# Altium schematic sheet FPGA.SchDoc
size A2
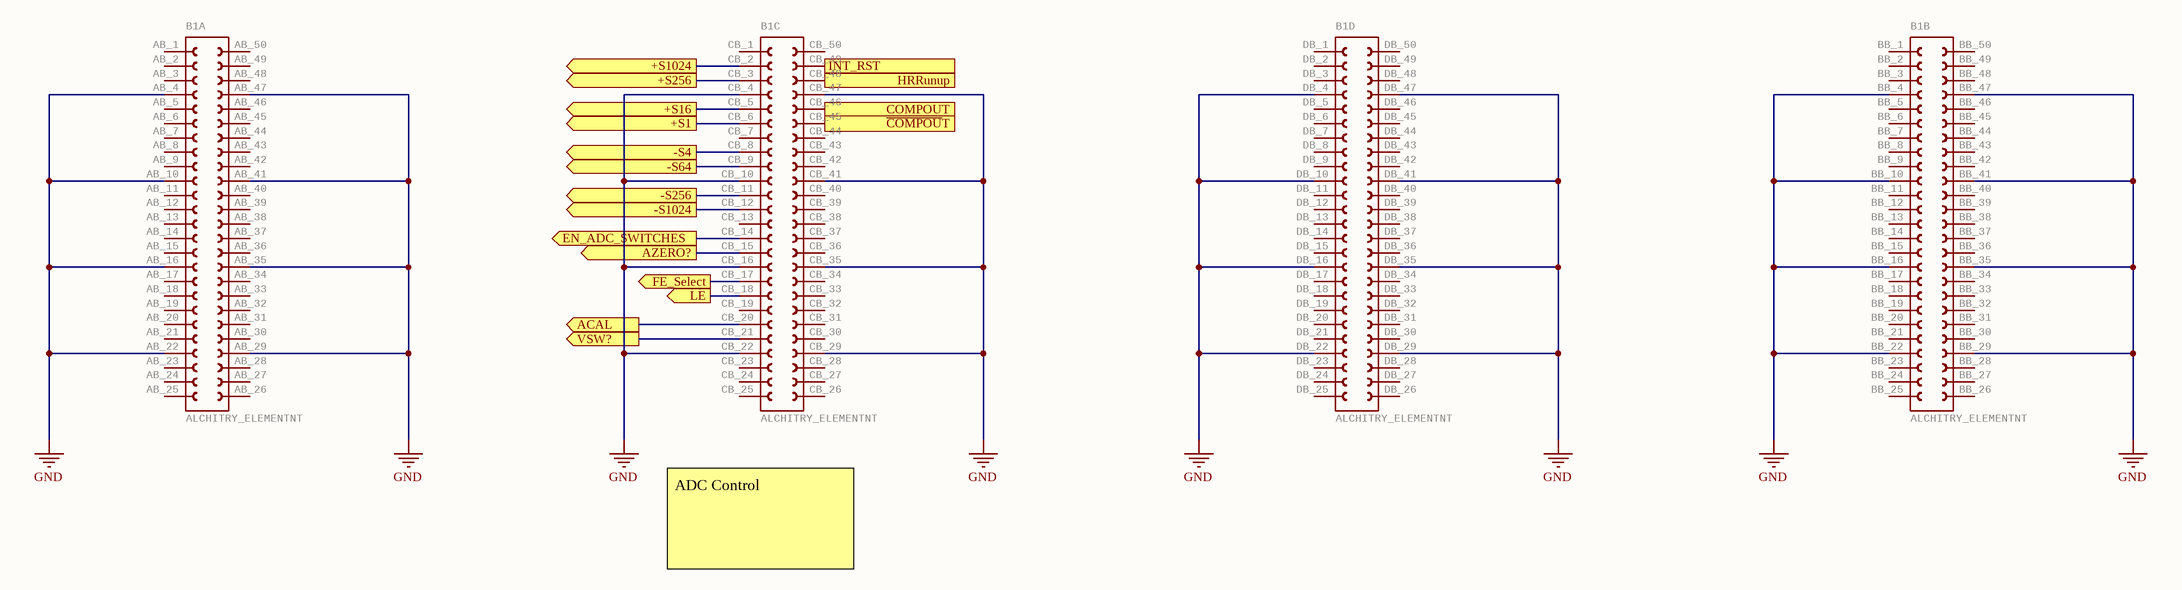
[diagram p0: FPGA.SchDoc]

## Parts
B1  ALCHITRY_ELEMENTNT  [ELEMENT_NO_TOP]  (parts A,B,C,D of 4)

## Ports
+S1 (out), +S16 (out), +S256 (out), +S1024 (out), -S4 (out), -S64 (out), -S256 (out), -S1024 (out), ACAL (out), AZERO? (out), COMPOUT (in), EN_ADC_SWITCHES (out), FE_Select (out), HRRunup (out), INT_RST (out), LE (out), VSW? (out), ~{COMPOU}T (in)

## Nets
GND: B1.AB_4 B1.AB_10 B1.AB_16 B1.AB_22 B1.AB_29 B1.AB_35 B1.AB_41 B1.AB_47 B1.BB_4 B1.BB_10 B1.BB_16 B1.BB_22 B1.BB_29 B1.BB_35 B1.BB_41 B1.BB_47 B1.CB_4 B1.CB_10 B1.CB_16 B1.CB_22 B1.CB_29 B1.CB_35 B1.CB_41 B1.CB_47 B1.DB_4 B1.DB_10 B1.DB_16 B1.DB_22 B1.DB_29 B1.DB_35 B1.DB_41 B1.DB_47
+S1: B1.CB_6 ; port +S1
+S16: B1.CB_5 ; port +S16
+S256: B1.CB_3 ; port +S256
+S1024: B1.CB_2 ; port +S1024
-S4: B1.CB_8 ; port -S4
-S64: B1.CB_9 ; port -S64
-S256: B1.CB_11 ; port -S256
-S1024: B1.CB_12 ; port -S1024
ACAL: B1.CB_20 ; port ACAL
AZERO?: B1.CB_15 ; port AZERO?
~{COMPOU}T: B1.CB_45 ; port ~{COMPOU}T
COMPOUT: B1.CB_46 ; port COMPOUT
EN_ADC_SWITCHES: B1.CB_14 ; port EN_ADC_SWITCHES
FE_Select: B1.CB_17 ; port FE_Select
HRRunup: B1.CB_48 ; port HRRunup
INT_RST: B1.CB_49 ; port INT_RST
LE: B1.CB_18 ; port LE
VSW?: B1.CB_21 ; port VSW?

Not connected (* = marked no-connect by the designer): B1 AB_1(1) AB_2(2) AB_3(3) AB_5(5) AB_6(6) AB_7(7) AB_8(8) AB_9(9) AB_11(11) AB_12(12) AB_13(13) AB_14(14) AB_15(15) AB_17(17) AB_18(18) AB_19(19) AB_20(20) AB_21(21) AB_23(23) AB_24(24) AB_25(25) AB_26(26) AB_27(27) AB_28(28) AB_30(30) AB_31(31) AB_32(32) AB_33(33) AB_34(34) AB_36(36) AB_37(37) AB_38(38) AB_39(39) AB_40(40) AB_42(42) AB_43(43) AB_44(44) AB_45(45) AB_46(46) AB_48(48) AB_49(49) AB_50(50) BB_1(1) BB_2(2) BB_3(3) BB_5(5) BB_6(6) BB_7(7) BB_8(8) BB_9(9) BB_11(11) BB_12(12) BB_13(13) BB_14(14) BB_15(15) BB_17(17) BB_18(18) BB_19(19) BB_20(20) BB_21(21) BB_23(23) BB_24(24) BB_25(25) BB_26(26) BB_27(27) BB_28(28) BB_30(30) BB_31(31) BB_32(32) BB_33(33) BB_34(34) BB_36(36) BB_37(37) BB_38(38) BB_39(39) BB_40(40) BB_42(42) BB_43(43) BB_44(44) BB_45(45) BB_46(46) BB_48(48) BB_49(49) BB_50(50) CB_1(1) CB_7(7) CB_13(13) CB_19(19) CB_23(23) CB_24(24) CB_25(25) CB_26(26) CB_27(27) CB_28(28) CB_30(30) CB_31(31) CB_32(32) CB_33(33) CB_34(34) CB_36(36) CB_37(37) CB_38(38) CB_39(39) CB_40(40) CB_42(42) CB_43(43) CB_44(44) CB_50(50) DB_1(1) DB_2(2) DB_3(3) DB_5(5) DB_6(6) DB_7(7) DB_8(8) DB_9(9) DB_11(11) DB_12(12) DB_13(13) DB_14(14) DB_15(15) DB_17(17) DB_18(18) DB_19(19) DB_20(20) DB_21(21) DB_23(23) DB_24(24) DB_25(25) DB_26(26) DB_27(27) DB_28(28) DB_30(30) DB_31(31) DB_32(32) DB_33(33) DB_34(34) DB_36(36) DB_37(37) DB_38(38) DB_39(39) DB_40(40) DB_42(42) DB_43(43) DB_44(44) DB_45(45) DB_46(46) DB_48(48) DB_49(49) DB_50(50)

## Notes on the sheet
- ADC Control

## Library data of the parts
B1 = ALCHITRY_ELEMENTNT: GateName_1: A; SymbolName_1: FE25-2; GateName_2: B; GateName_3: C; GateName_4: D; DeviceName: NT; SymbolName_2: FE25-2; SymbolName_3: FE25-2; SymbolName_4: FE25-2; LibraryName: alchitry_elements; DeviceSetName: ALCHITRY_ELEMENT; Package: ELEMENT_NO_TOP